# Altium schematic sheet STM32_PINS.SchDoc
size A4
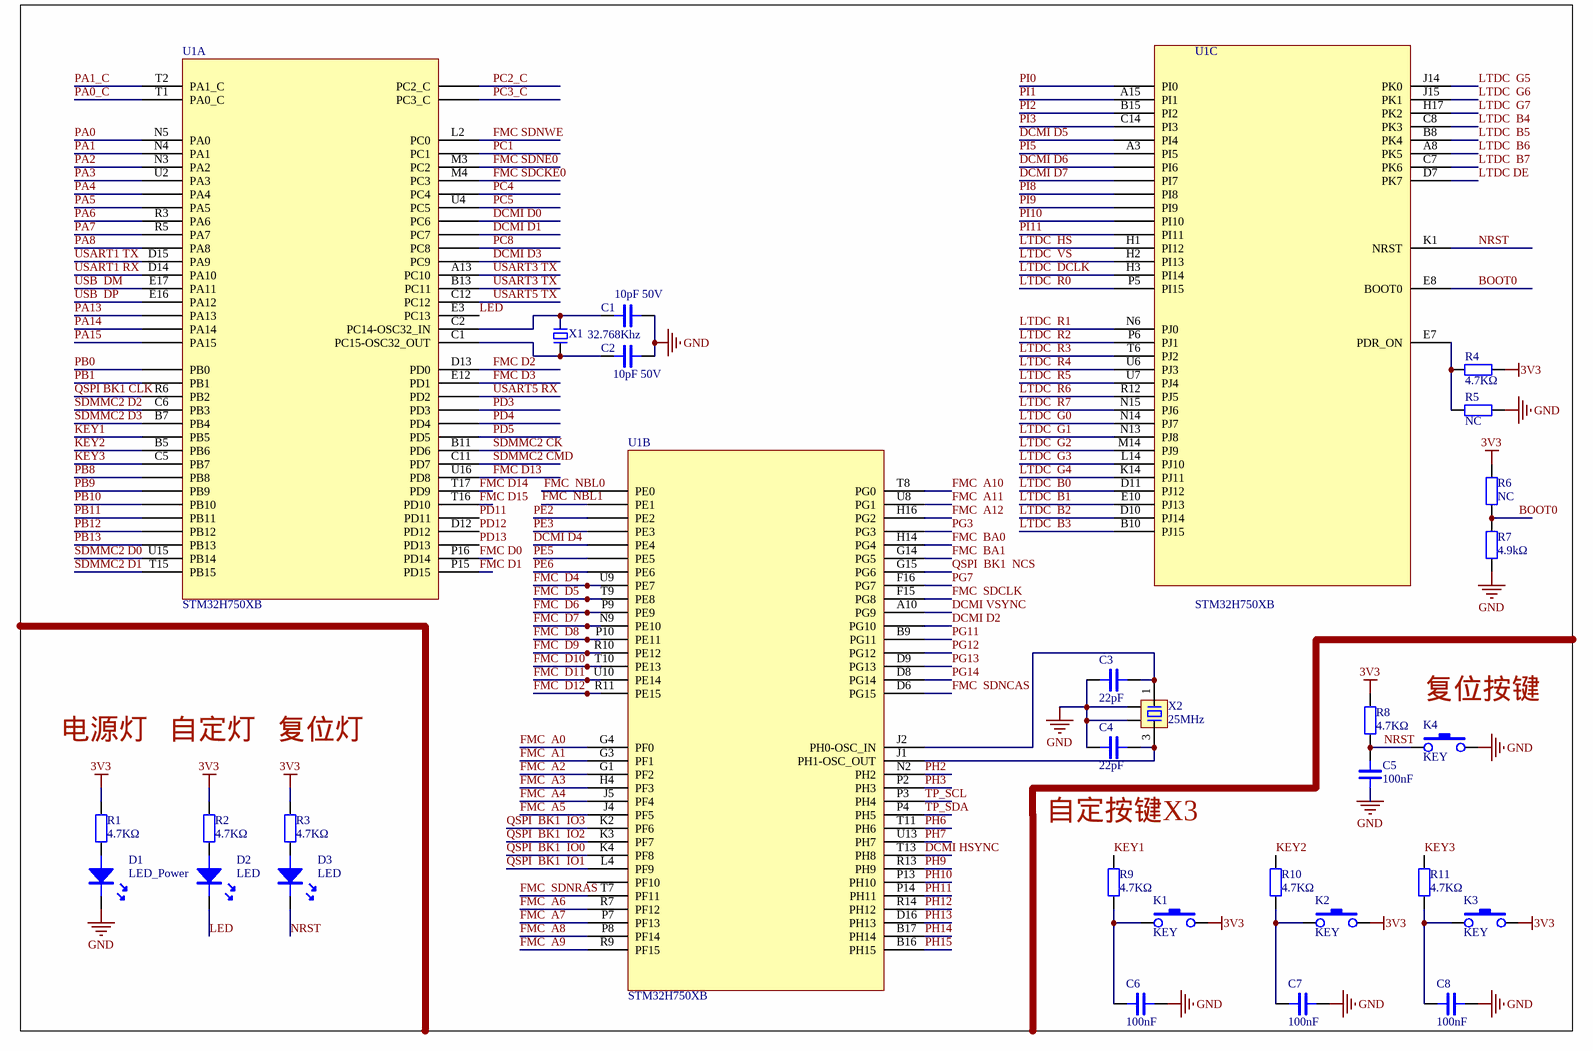
[diagram p0: STM32_PINS.SchDoc]

## Parts
C1  10pF 50V  [0805C]
C2  10pF 50V  [0805C]
C3  22pF  [0805C]
C4  22pF  [0805C]
C5  100nF  [0805C]
C6  100nF  [0805C]
C7  100nF  [0805C]
C8  100nF  [0805C]
D1  LED_Power  [LED5-BLUE]
D2  LED  [LED5-BLUE]
D3  LED  [LED5-BLUE]
K1  KEY  [DIP-3X6X4.3]
K2  KEY  [DIP-3X6X4.3]
K3  KEY  [DIP-3X6X4.3]
K4  KEY  [DIP-3X6X4.3]
R1  4.7KΩ  [0805]
R2  4.7KΩ  [0805]
R3  4.7KΩ  [0805]
R4  4.7KΩ  [0805]
R5  NC  [0805]
R6  NC  [0805]
R7  4.9kΩ  [0805]
R8  4.7KΩ  [0805]
R9  4.7KΩ  [0805]
R10  4.7KΩ  [0805]
R11  4.7KΩ  [0805]
U1  STM32H750XB  [BGA265C80P17X17_1400X1400X110]  (parts A,B,C of 4)
X1  32.768Khz  [OSC HC-49S]
X2  25MHz  [OSC 1612-4P]

## Nets
3V3: K1.3 K2.3 K3.3 R1.2 R2.2 R3.2 R4.2 R6.2 R8.2
GND: C1.2 C2.1 C3.2 C4.2 C5.2 C6.1 C7.1 C8.1 D1.K K4.3 R5.2 R7.1 X2.2 X2.4
BOOT0: R6.1 R7.2 U1.E8(BOOT0)
DCMI D0: U1.?18(PC6)
DCMI D1: U1.?19(PC7)
DCMI D2: U1.?10(PG10)
DCMI D3: U1.?21(PC9)
DCMI D4: U1.?5(PE4)
DCMI D5: U1.?2(PI4)
DCMI D6: U1.?3(PI6)
DCMI D7: U1.?4(PI7)
DCMI HSYNC: U1.T13(PH8)
DCMI VSYNC: U1.A10(PG9)
FMC  A0: U1.G4(PF0)
FMC  A1: U1.G3(PF1)
FMC  A2: U1.G1(PF2)
FMC  A3: U1.H4(PF3)
FMC  A4: U1.J5(PF4)
FMC  A5: U1.J4(PF5)
FMC  A6: U1.R7(PF12)
FMC  A7: U1.P7(PF13)
FMC  A8: U1.P8(PF14)
FMC  A9: U1.R9(PF15)
FMC  A10: U1.T8(PG0)
FMC  A11: U1.U8(PG1)
FMC  A12: U1.H16(PG2)
FMC  BA0: U1.H14(PG4)
FMC  BA1: U1.G14(PG5)
FMC  D4: U1.U9(PE7)
FMC  D5: U1.T9(PE8)
FMC  D6: U1.P9(PE9)
FMC  D7: U1.N9(PE10)
FMC  D8: U1.P10(PE11)
FMC  D9: U1.R10(PE12)
FMC  D10: U1.T10(PE13)
FMC  D11: U1.U10(PE14)
FMC  D12: U1.R11(PE15)
FMC  NBL0: U1.?1(PE0)
FMC  SDCLK: U1.F15(PG8)
FMC  SDNCAS: U1.D6(PG15)
FMC  SDNRAS: U1.T7(PF11)
FMC D0: U1.P16(PD14)
FMC D1: U1.P15(PD15)
FMC D2: U1.D13(PD0)
FMC D3: U1.E12(PD1)
FMC D13: U1.U16(PD8)
FMC D14: U1.T17(PD9)
FMC D15: U1.T16(PD10)
FMC SDCKE0: U1.M4(PC3)
FMC SDNE0: U1.M3(PC2)
FMC SDNWE: U1.L2(PC0)
KEY1: R9.1 U1.?9(PB5)
KEY2: R10.1 U1.B5(PB6)
KEY3: R11.1 U1.C5(PB7)
LED: D2.K U1.E3(PC13)
LTDC  B0: U1.D11(PJ12)
LTDC  B1: U1.E10(PJ13)
LTDC  B2: U1.D10(PJ14)
LTDC  B3: U1.B10(PJ15)
LTDC  B4: U1.C8(PK3)
LTDC  B5: U1.B8(PK4)
LTDC  B6: U1.A8(PK5)
LTDC  B7: U1.C7(PK6)
LTDC  DCLK: U1.H3(PI14)
LTDC  G0: U1.N14(PJ7)
LTDC  G1: U1.N13(PJ8)
LTDC  G2: U1.M14(PJ9)
LTDC  G3: U1.L14(PJ10)
LTDC  G4: U1.K14(PJ11)
LTDC  G5: U1.J14(PK0)
LTDC  G6: U1.J15(PK1)
LTDC  G7: U1.H17(PK2)
LTDC  HS: U1.H1(PI12)
LTDC  R0: U1.P5(PI15)
LTDC  R1: U1.N6(PJ0)
LTDC  R2: U1.P6(PJ1)
LTDC  R3: U1.T6(PJ2)
LTDC  R4: U1.U6(PJ3)
LTDC  R5: U1.U7(PJ4)
LTDC  R6: U1.R12(PJ5)
LTDC  R7: U1.N15(PJ6)
LTDC  VS: U1.H2(PI13)
LTDC DE: U1.D7(PK7)
NRST: C5.1 D3.K K4.1 R8.1 U1.K1(NRST)
PA0: U1.N5(PA0)
PA0_C: U1.T1(PA0_C)
PA1: U1.N4(PA1)
PA1_C: U1.T2(PA1_C)
PA2: U1.N3(PA2)
PA3: U1.U2(PA3)
PA4: U1.?1(PA4)
PA5: U1.?2(PA5)
PA6: U1.R3(PA6)
PA7: U1.R5(PA7)
PA8: U1.?3(PA8)
PA13: U1.?4(PA13)
PA14: U1.?5(PA14)
PA15: U1.?6(PA15)
PB0: U1.?7(PB0)
PB1: U1.?8(PB1)
PB8: U1.?10(PB8)
PB9: U1.?11(PB9)
PB10: U1.?12(PB10)
PB11: U1.?13(PB11)
PB12: U1.?14(PB12)
PB13: U1.?15(PB13)
PC1: U1.?16(PC1)
PC2_C: U1.?28(PC2_C)
PC3_C: U1.?29(PC3_C)
PC4: U1.?17(PC4)
PC5: U1.U4(PC5)
PC8: U1.?20(PC8)
PD3: U1.?23(PD3)
PD4: U1.?24(PD4)
PD5: U1.?25(PD5)
PD11: U1.?26(PD11)
PD12: U1.D12(PD12)
PD13: U1.?27(PD13)
PE2: U1.?3(PE2)
PE3: U1.?4(PE3)
PE5: U1.?6(PE5)
PE6: U1.?7(PE6)
PG3: U1.?9(PG3)
PG7: U1.F16(PG7)
PG11: U1.B9(PG11)
PG12: U1.?11(PG12)
PG13: U1.D9(PG13)
PG14: U1.D8(PG14)
PH2: U1.N2(PH2)
PH3: U1.P2(PH3)
PH6: U1.T11(PH6)
PH7: U1.U13(PH7)
PH9: U1.R13(PH9)
PH10: U1.P13(PH10)
PH11: U1.P14(PH11)
PH12: U1.R14(PH12)
PH13: U1.D16(PH13)
PH14: U1.B17(PH14)
PH15: U1.B16(PH15)
PI0: U1.?1(PI0)
PI1: U1.A15(PI1)
PI2: U1.B15(PI2)
PI3: U1.C14(PI3)
PI5: U1.A3(PI5)
PI8: U1.?5(PI8)
PI9: U1.?6(PI9)
PI10: U1.?7(PI10)
PI11: U1.?8(PI11)
QSPI  BK1  IO0: U1.K4(PF8)
QSPI  BK1  IO1: U1.L4(PF9)
QSPI  BK1  IO2: U1.K3(PF7)
QSPI  BK1  IO3: U1.K2(PF6)
QSPI  BK1  NCS: U1.G15(PG6)
QSPI BK1 CLK: U1.R6(PB2)
SDMMC2 CK: U1.B11(PD6)
SDMMC2 CMD: U1.C11(PD7)
SDMMC2 D0: U1.U15(PB14)
SDMMC2 D1: U1.T15(PB15)
SDMMC2 D2: U1.C6(PB3)
SDMMC2 D3: U1.B7(PB4)
TP_SCL: U1.P3(PH4)
TP_SDA: U1.P4(PH5)
USART1 RX: U1.D14(PA10)
USART1 TX: U1.D15(PA9)
USART3 TX: U1.A13(PC10) U1.B13(PC11)
USART5 RX: U1.?22(PD2)
USART5 TX: U1.C12(PC12)
USB  DM: U1.E17(PA11)
USB  DP: U1.E16(PA12)
NetC1_1: C1.1 U1.C2(PC14-OSC32_IN) X1.2
NetC2_2: C2.2 U1.C1(PC15-OSC32_OUT) X1.1
NetC3_1: C3.1 U1.J2(PH0-OSC_IN) X2.1
NetC4_1: C4.1 U1.J1(PH1-OSC_OUT) X2.3
NetC6_2: C6.2 K1.1 R9.2
NetC7_2: C7.2 K2.1 R10.2
NetC8_2: C8.2 K3.1 R11.2
NetR4_1: R4.1 R5.1 U1.E7(PDR_ON)

Not connected (* = marked no-connect by the designer): D1 A; D2 A; D3 A; R1 1; R2 1; R3 1

## Notes on the sheet
- 复位按键
- 电源灯
- 自定灯
- 复位灯
- 自定按键X3
- Labels drawn without touching a wire or pin: FMC  NBL1

## Library data of the parts
C1-C8 = CAP: Capacitor
D1 = LED
R1-R11 = RES: Resistor
X1 = XTAL-2P: 2脚无源脚晶振
X2 = XTAL-4P: 4脚无源晶振